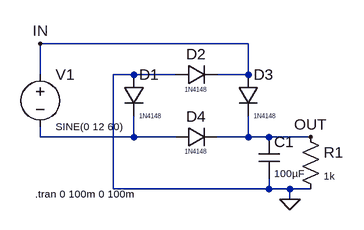
[diagram p0: schematic schematic.asc]
schematic.asc, the LTspice schematic file:
Version 4.1
SHEET 1 880 680
WIRE 288 128 -32 128
WIRE -32 176 -32 128
WIRE 112 176 80 176
WIRE 176 176 112 176
WIRE 288 176 288 128
WIRE 288 176 240 176
WIRE -32 272 -32 256
WIRE 112 272 112 240
WIRE 112 272 -32 272
WIRE 176 272 112 272
WIRE 288 272 288 240
WIRE 288 272 240 272
WIRE 320 272 288 272
WIRE 384 272 320 272
WIRE 80 352 80 176
WIRE 320 352 320 336
WIRE 320 352 80 352
WIRE 352 352 320 352
WIRE 384 352 352 352
WIRE 352 368 352 352
FLAG -32 128 IN
FLAG 384 272 OUT
FLAG 352 368 0
SYMBOL voltage -32 160 R0
WINDOW 3 24 96 Left 1
SYMATTR InstName V1
SYMATTR Value SINE(0 12 60)
SYMBOL diode 96 176 R0
WINDOW 3 24 64 Left 0
SYMATTR InstName D1
SYMATTR Value 1N4148
SYMBOL diode 176 192 R270
WINDOW 0 32 32 VTop 2
WINDOW 3 0 32 VBottom 0
SYMATTR InstName D2
SYMATTR Value 1N4148
SYMBOL diode 272 176 R0
WINDOW 3 24 64 Left 0
SYMATTR InstName D3
SYMATTR Value 1N4148
SYMBOL diode 176 288 R270
WINDOW 0 32 32 VTop 2
WINDOW 3 0 32 VBottom 0
SYMATTR InstName D4
SYMATTR Value 1N4148
SYMBOL res 368 256 R0
WINDOW 3 36 76 Left 1
SYMATTR InstName R1
SYMATTR Value 1k
SYMBOL cap 304 272 R0
WINDOW 3 24 56 Left 1
SYMATTR InstName C1
SYMATTR Value 100µF
TEXT -40 360 Left 1 !.tran 0 100m 0 100m

The netlist it stands for:
* schematic.asc
V1 IN N001 SINE(0 12 60)
D1 0 N001 1N4148
D2 0 IN 1N4148
D3 IN OUT 1N4148
D4 N001 OUT 1N4148
R1 OUT 0 1k
C1 OUT 0 100µF
.model D D
.lib standard.dio
.tran 0 100m 0 100m
.backanno
.end